# EasyEDA schematic SCH_humidity_esp32_2023-06-02.json
TITLE: Sheet_1; REV: 1.0; Date: 2023-05-29; Sheet: 1/1; Drawn By: Arvydas Tomkus (Liquidas); Company: Your Company
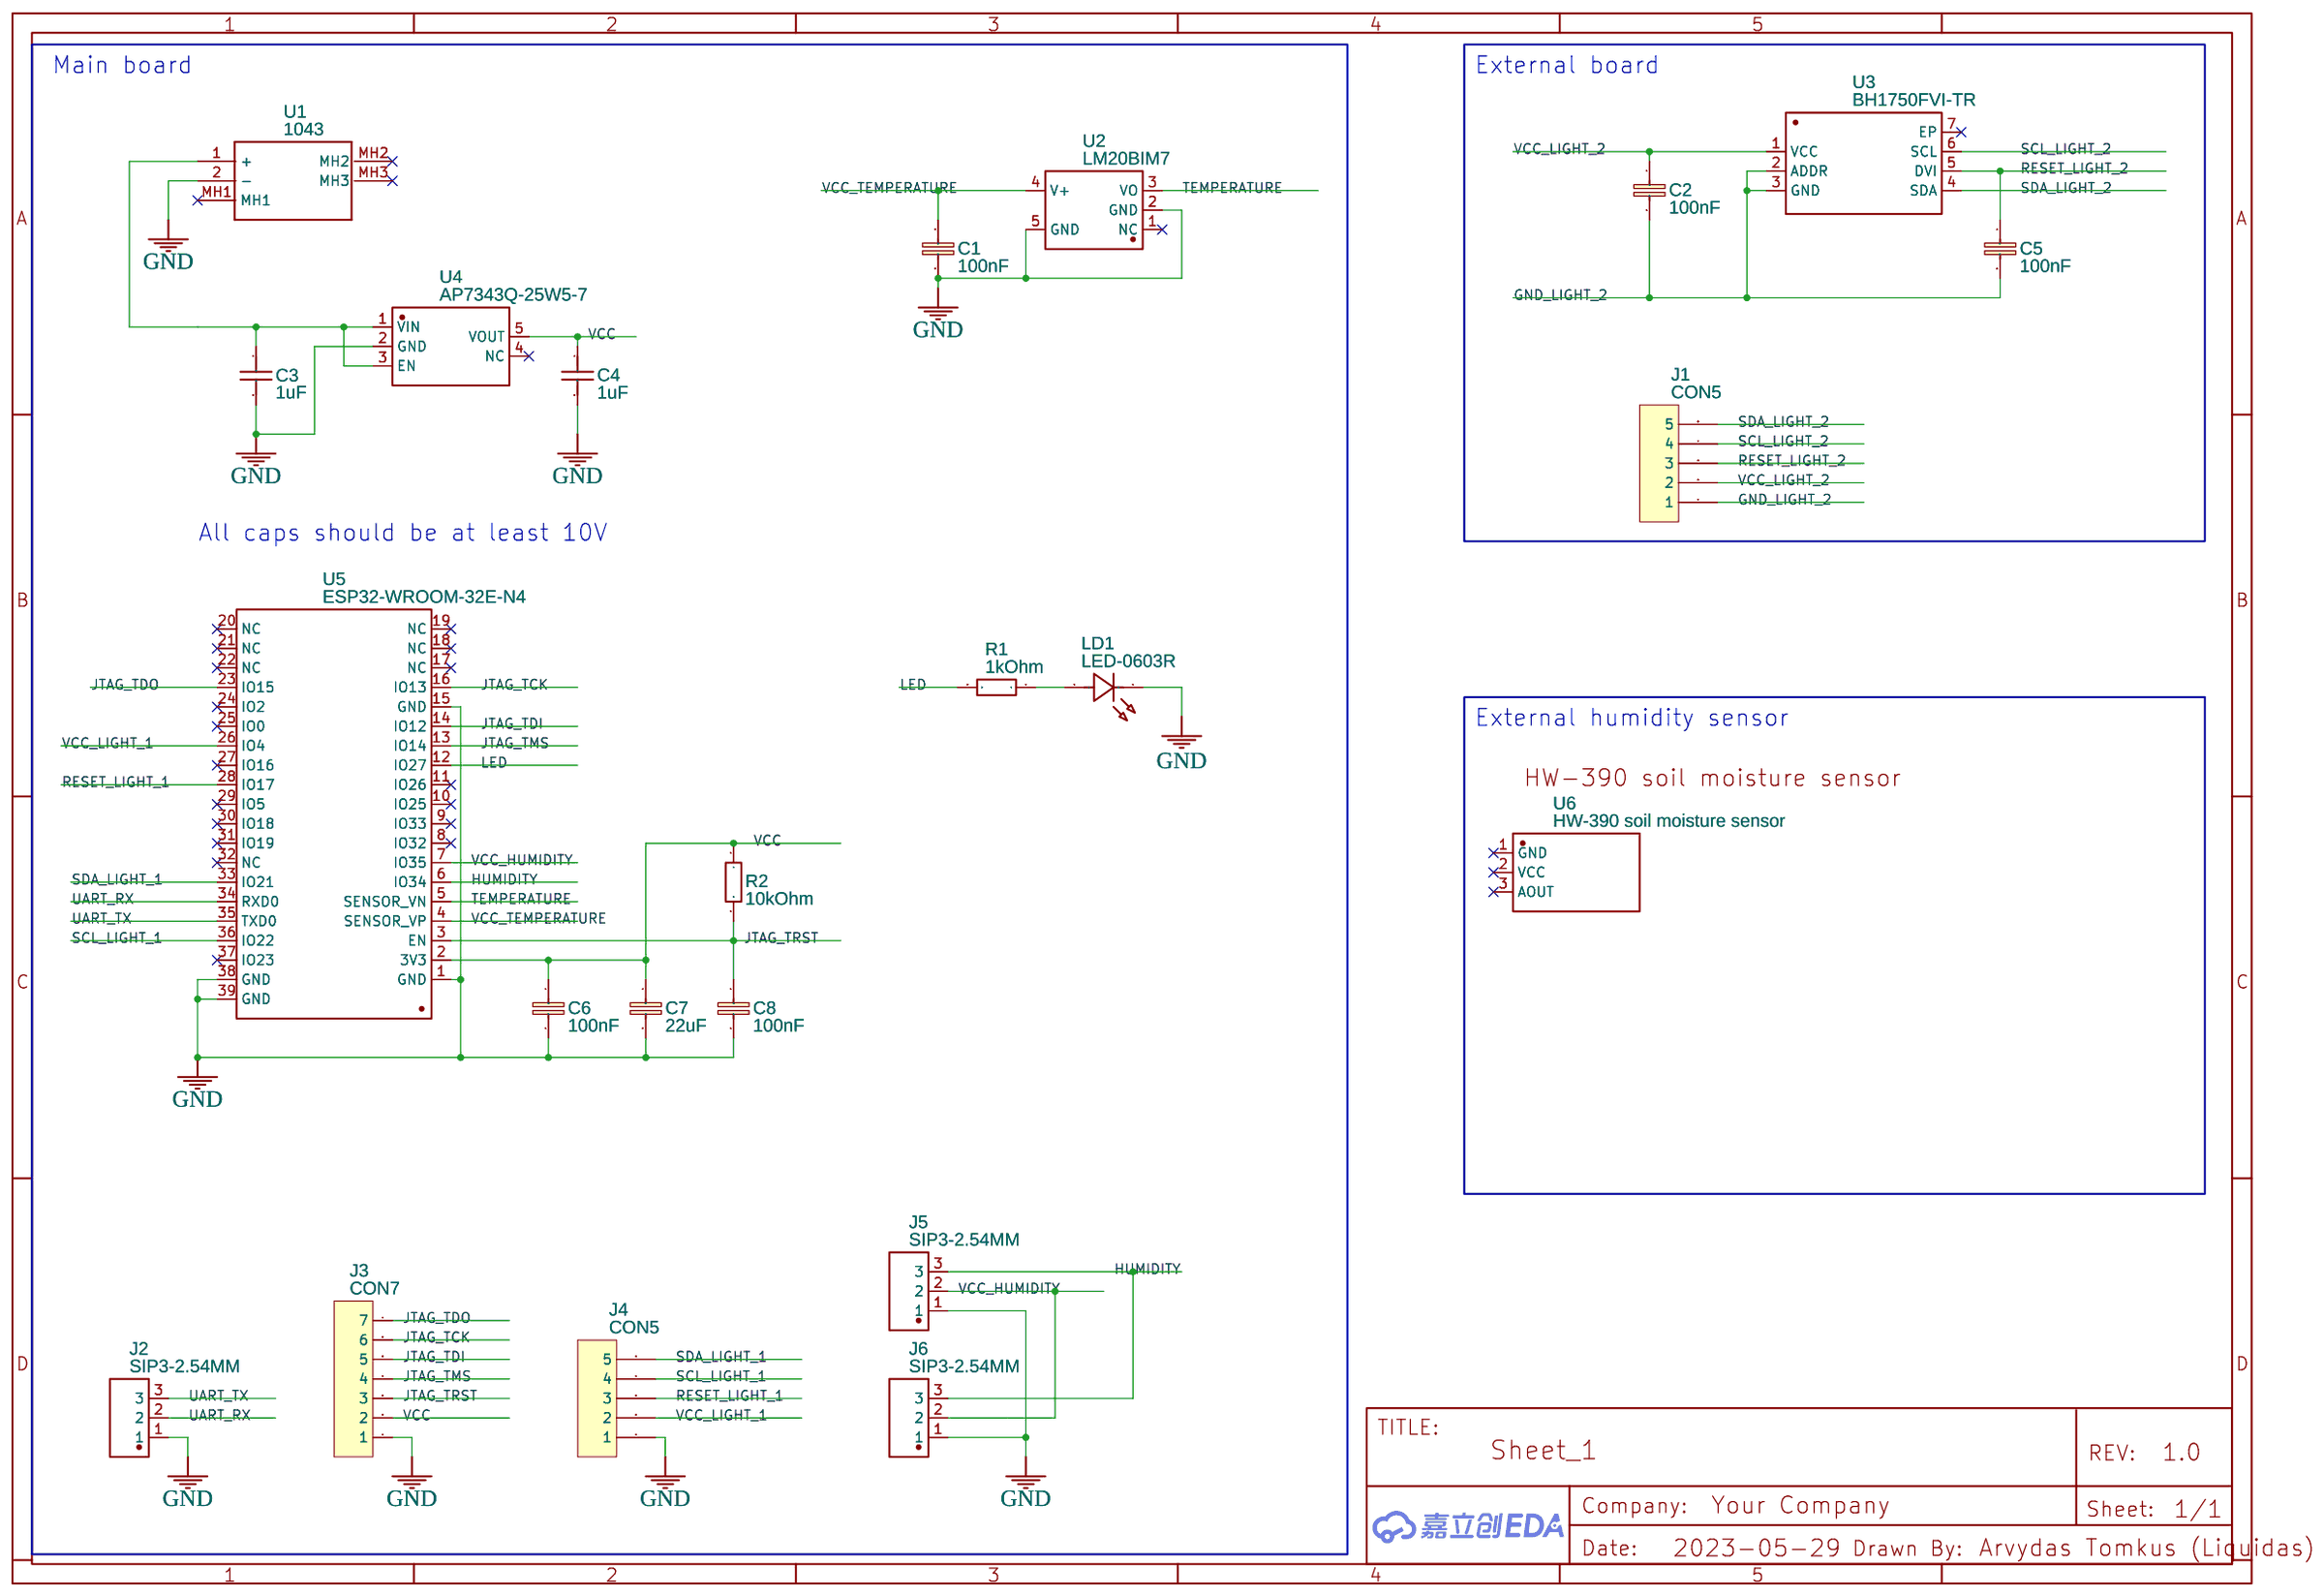
[diagram p0: schematic sheet]

## Parts
C1  100nF  [SPARKFUN-CAPACITORS_0603-CAP]
C2  100nF  [SPARKFUN-CAPACITORS_0603-CAP]
C3  1uF  [CAPACITOR C1206]
C4  1uF  [CAPACITOR C1206]
C5  100nF  [SPARKFUN-CAPACITORS_0603-CAP]
C6  100nF  [SPARKFUN-CAPACITORS_0603-CAP]
C7  22uF  [SPARKFUN-CAPACITORS_0603-CAP]
C8  100nF  [SPARKFUN-CAPACITORS_0603-CAP]
J1  CON5  [SIP5]
J2  SIP3-2.54MM  [HDR-TH_5P-P2.54-V-M]
J3  CON7  [SIP7]
J4  CON5  [SIP5]
J5  SIP3-2.54MM  [HDR-TH_5P-P2.54-V-M]
J6  SIP3-2.54MM  [HDR-TH_5P-P2.54-V-M]
LD1  LED-0603R  [LED0603-RD_RED]
R1  1kOhm  [R0603]
R2  10kOhm  [R0603]
U1  1043  [1043]
U2  LM20BIM7  [SC-70-5_L2.0-W1.3-P0.65-LS2.1-BR]
U3  BH1750FVI-TR  [WSOF-6_L2.6-W1.6-P0.50-TL-EP]
U4  AP7343Q-25W5-7  [SOT-25_L3.0-W1.6-P0.95-LS2.8-BL]
U5  ESP32-WROOM-32E-N4  [WIFI-SMD_ESP32-WROOM-32E-A]
U6  HW-390 soil moisture sensor  [HW-390]

## Library data of the parts
C1 C2 C5-C8 = SPARKFUN-CAPACITORS_CAP0603-CAP: Contributor: lasvit.maty; Manufacturer Part: C0603C104K4RAC7867; Supplier: Mouser
C3 C4 = Capacitor SMD 1206: Manufacturer Part: T491A105K010AT; Supplier: Mouser; Contributor: First Bro
J1 J4 = CON5: Contributor: tomfavell
J2 J5 J6 = SIP3-2.54MM: Supplier: LCSC; Supplier Part: C9900009053; Manufacturer: null; Manufacturer Part: SIP5-2.54mm; Contributor: giorgio.siviero.82
J3 = CON7: Contributor: Ksh7
LD1 = LED-0603R: Supplier: Mouser; Manufacturer Part: 150060RS75000; JLCPCB Part Class: Extended Part; Contributor: lcsc
R1 R2 = 1K-R0603: Supplier: LCSC; Supplier Part: C9900009267; Manufacturer: null; link: https://atta.szlcsc.comnull; Contributor: LCSC; JLCPCB Part Class: Extended Part
U1 = 1043: Contributor: Laurizzz; Manufacturer: Keystone Electronics; Supplier: Mouser
U2 = LM20BIM7: Supplier: Mouser; Manufacturer: TI; Contributor: lcsc
U3 = BH1750FVI-TR: Supplier: LCSC; Manufacturer: ROHM(罗姆); Supplier Part: C78960; JLCPCB Part Class: Extended Part
U4 = AP7343-12W5-7: Supplier: Mouser; JLCPCB Part Class: Extended Part; Contributor: lcsc
U5 = ESP32-WROOM-32E-N4: Supplier: Mouser; Manufacturer: ESPRESSIF(乐鑫); link: https://atta.szlcsc.com/upload/public/pdf/source/20220506/2B7DF1E5B41DABC7447F735C715CAF22.pdf; Contributor: lcsc
U6 = HW-390 soil moisture sensor: Contributor: tomkusarvydas

## Nets
GND: C1.2 C3.2 C4.2 C6.2 C7.2 C8.2 J2.1 J3.1 J4.1 J5.1 J6.1 LD1.1(K) U1.2(-) U2.2(GND) U2.5(GND) U4.2(GND) U5.1(GND) U5.15(GND) U5.38(GND) U5.39(GND)
GND_LIGHT_2: C2.2 C5.2 J1.1 U3.2(ADDR) U3.3(GND)
VCC: C4.1 C6.1 C7.1 J3.2 R2.1 U4.5(VOUT) U5.2(3V3)
VCC_HUMIDITY: J5.2 J6.2 U5.7(IO35)
VCC_LIGHT_1: J4.2 U5.26(IO4)
VCC_LIGHT_2: C2.1 J1.2 U3.1(VCC)
VCC_TEMPERATURE: C1.1 U2.4(V+) U5.4(SENSOR_VP)
HUMIDITY: J5.3 J6.3 U5.6(IO34)
JTAG_TCK: J3.6 U5.16(IO13)
JTAG_TDI: J3.5 U5.14(IO12)
JTAG_TDO: J3.7 U5.23(IO15)
JTAG_TMS: J3.4 U5.13(IO14)
JTAG_TRST: C8.1 J3.3 R2.2 U5.3(EN)
LED: R1.2 U5.12(IO27)
RESET_LIGHT_1: J4.3 U5.28(IO17)
RESET_LIGHT_2: C5.1 J1.3 U3.5(DVI)
SCL_LIGHT_1: J4.4 U5.36(IO22)
SCL_LIGHT_2: J1.4 U3.6(SCL)
SDA_LIGHT_1: J4.5 U5.33(IO21)
SDA_LIGHT_2: J1.5 U3.4(SDA)
TEMPERATURE: U2.3(VO) U5.5(SENSOR_VN)
UART_RX: J2.2 U5.34(RXD0)
UART_TX: J2.3 U5.35(TXD0)
Net-(C3-1): C3.1 U1.1(+) U4.1(VIN) U4.3(EN)
Net-(LD1-2): LD1.2(A) R1.1

Not connected (* = marked no-connect by the designer): U1 MH1* MH2* MH3*; U2 1(NC)*; U3 7(EP)*; U4 4(NC)*; U5 8(IO32)* 9(IO33)* 10(IO25)* 11(IO26)* 17(NC)* 18(NC)* 19(NC)* 20(NC)* 21(NC)* 22(NC)* 24(IO2)* 25(IO0)* 27(IO16)* 29(IO5)* 30(IO18)* 31(IO19)* 32(NC)* 37(IO23)*; U6 1(GND)* 2(VCC)* 3(AOUT)*

## Notes on the sheet
- Main board
- External board
- All caps should be at least 10V
- External humidity sensor
